# EAGLE design sfg_clone (EAGLE 6.5.0)
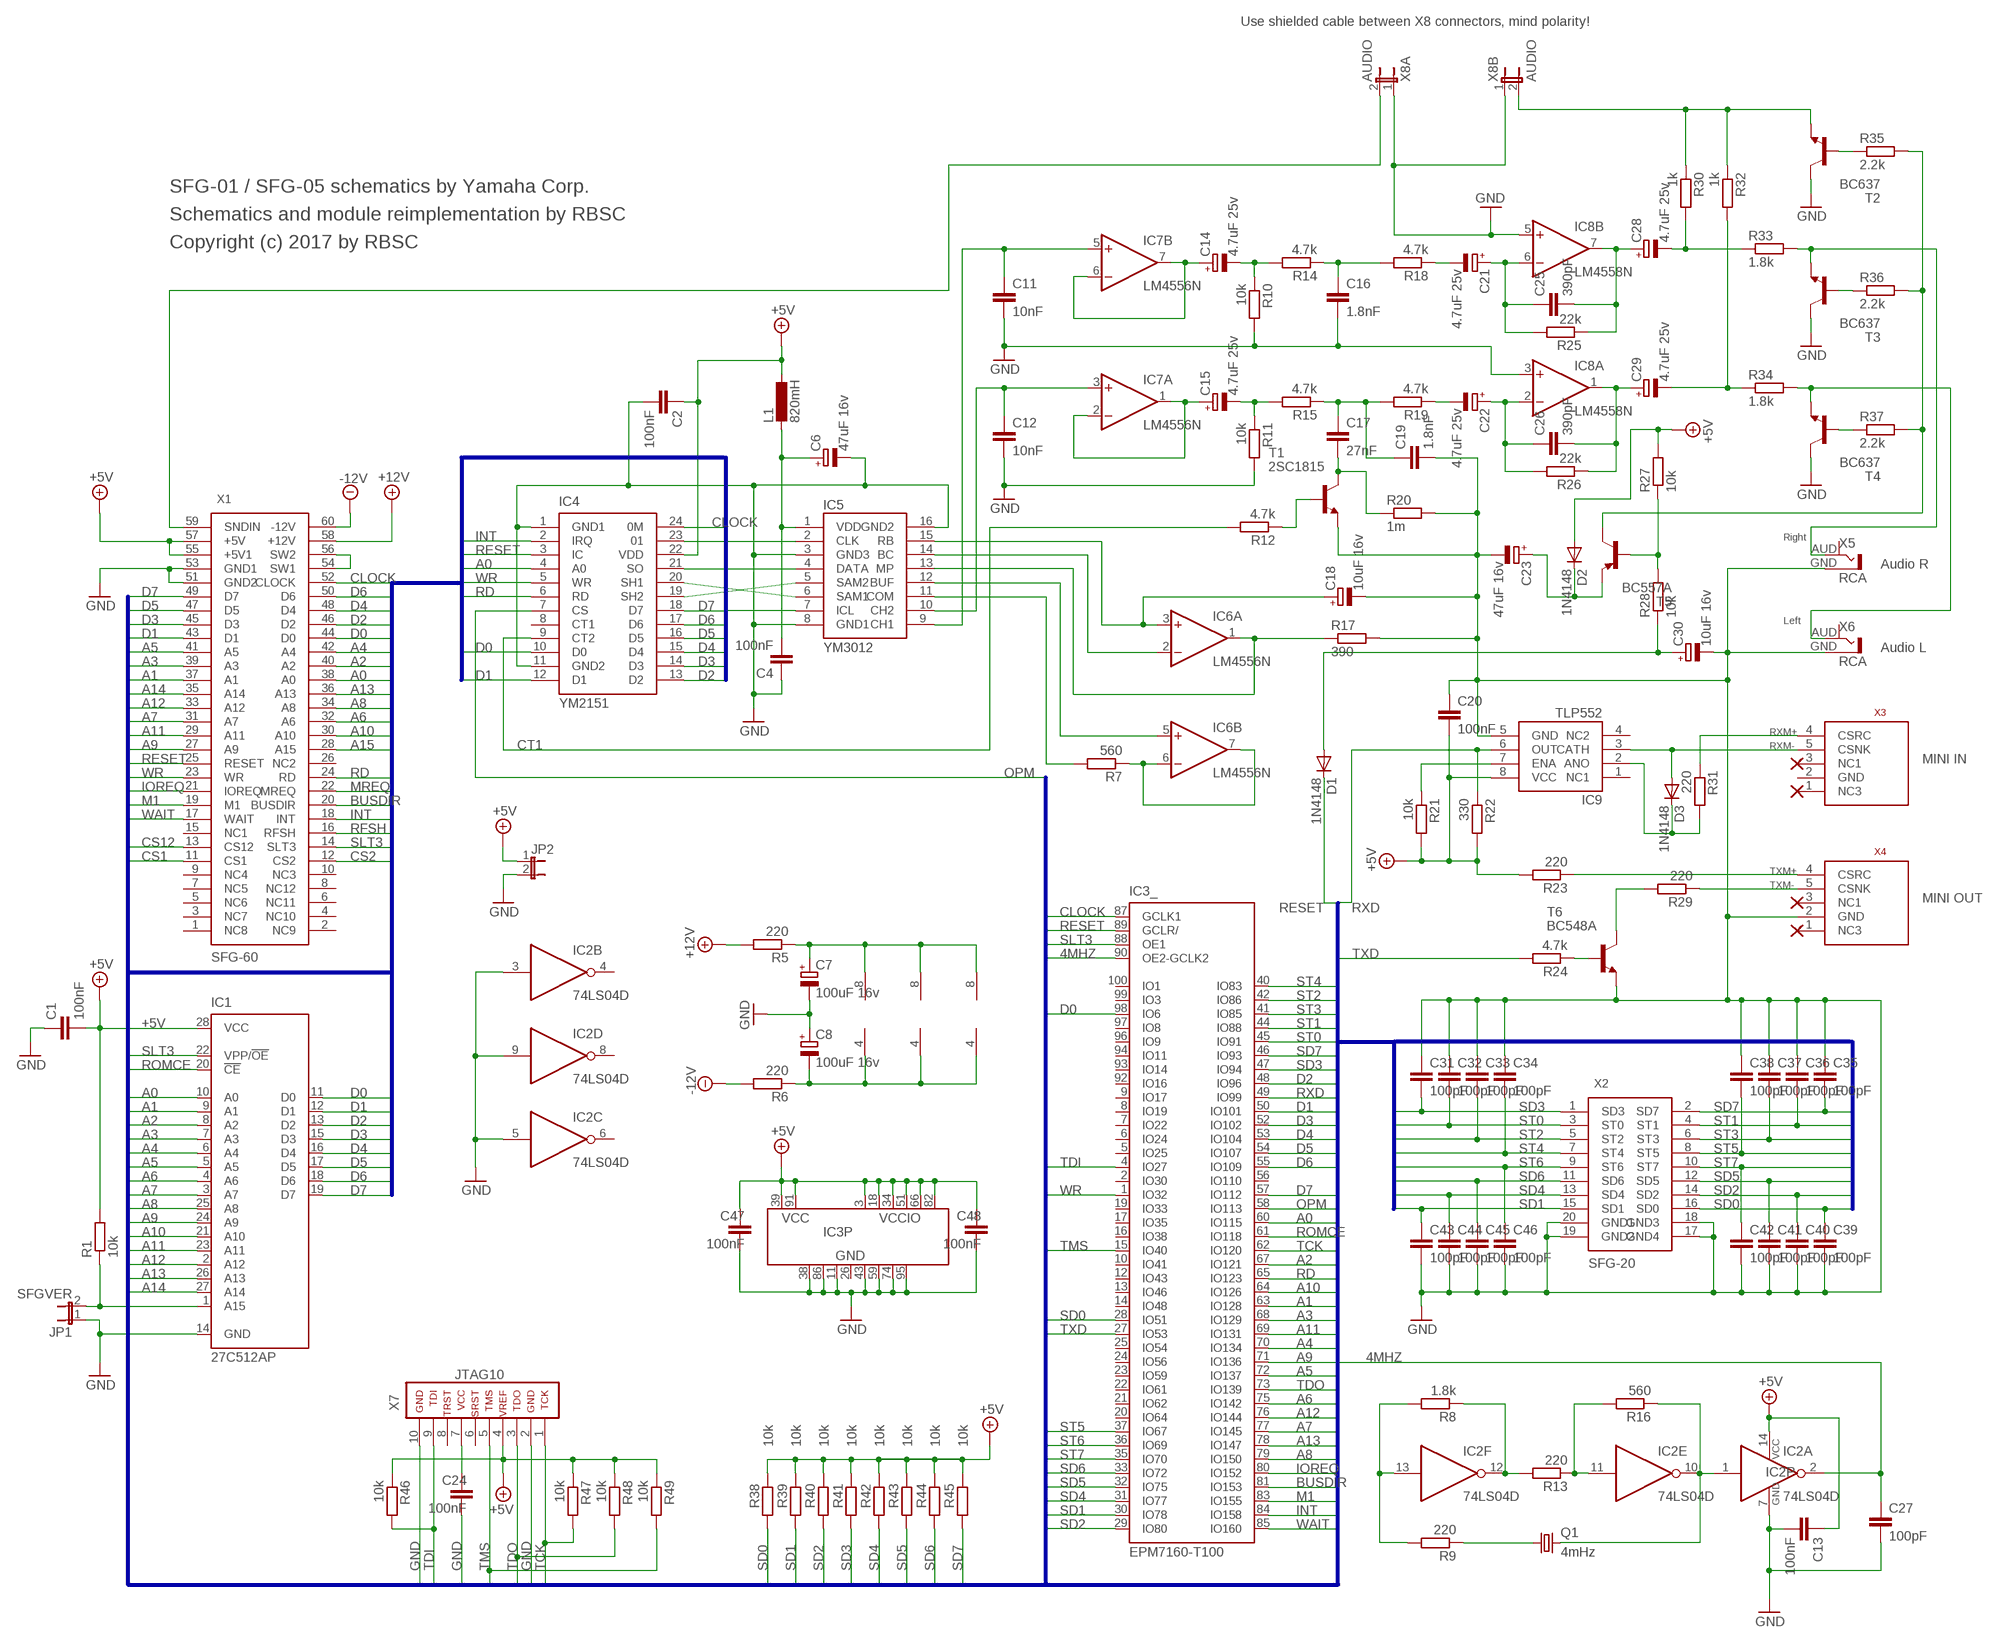
[diagram p0: schematic, sheet 1]

## Parts
C1  100nF  C-EUC0805  [C0805]
C2  100nF  C-EUC0805  [C0805]
C4  100nF  C-EUC0805  [C0805]
C6  47uF 16v  CPOL-EUSMCC  [SMC_C]
C7  100uF 16v  CPOL-EUSMCD  [SMC_D]
C8  100uF 16v  CPOL-EUSMCD  [SMC_D]
C11  10nF  C-EUC0805  [C0805]
C12  10nF  C-EUC0805  [C0805]
C13  100nF  C-EUC0805  [C0805]
C14  4.7uF 25v  CPOL-EUSMCB  [SMC_B]
C15  4.7uF 25v  CPOL-EUSMCB  [SMC_B]
C16  1.8nF  C-EUC0805  [C0805]
C17  27nF  C-EUC0805  [C0805]
C18  10uF 16v  CPOL-EUSMCB  [SMC_B]
C19  1.8nF  C-EUC0805  [C0805]
C20  100nF  C-EUC0805  [C0805]
C21  4.7uF 25v  CPOL-EUSMCB  [SMC_B]
C22  4.7uF 25v  CPOL-EUSMCB  [SMC_B]
C23  47uF 16v  CPOL-EUSMCC  [SMC_C]
C24  100nF  C-EUC0805  [C0805]
C25  390pF  C-EUC0805  [C0805]
C26  390pF  C-EUC0805  [C0805]
C27  100pF  C-EUC0805  [C0805]
C28  4.7uF 25v  CPOL-EUSMCB  [SMC_B]
C29  4.7uF 25v  CPOL-EUSMCB  [SMC_B]
C30  10uF 16v  CPOL-EUSMCB  [SMC_B]
C31  100pF  C-EUC0805  [C0805]
C32  100pF  C-EUC0805  [C0805]
C33  100pF  C-EUC0805  [C0805]
C34  100pF  C-EUC0805  [C0805]
C35  100pF  C-EUC0805  [C0805]
C36  100pF  C-EUC0805  [C0805]
C37  100pF  C-EUC0805  [C0805]
C38  100pF  C-EUC0805  [C0805]
C39  100pF  C-EUC0805  [C0805]
C40  100pF  C-EUC0805  [C0805]
C41  100pF  C-EUC0805  [C0805]
C42  100pF  C-EUC0805  [C0805]
C43  100pF  C-EUC0805  [C0805]
C44  100pF  C-EUC0805  [C0805]
C45  100pF  C-EUC0805  [C0805]
C46  100pF  C-EUC0805  [C0805]
C47  100nF  C-EUC0805  [C0805]
C48  100nF  C-EUC0805  [C0805]
D1  1N4148  DIODE-MINIMELF  [MINIMELF]
D2  1N4148  DIODE-MINIMELF  [MINIMELF]
D3  1N4148  DIODE-MINIMELF  [MINIMELF]
IC1  27C512AP  [DIL28-6]
IC2  74LS04D  [SO14]
IC3  EPM7160-T100  [TQFP100]
IC4  YM2151  [DIL24]
IC5  YM3012  [DIL16]
IC6  LM4556N  [DIL08]
IC7  LM4556N  [DIL08]
IC8  LM4558N  [DIL08]
IC9  TLP552  [DIL08]
JP1  SFGVER  JP1E  [JP1]
JP2  JP1E  [JP1]
L1  820mH  L-EU6000-XXX-RC  [6000-XXXX-RC]
Q1  4mHz  CRYSTALHC49S  [HC49/S]
R1  10k  R-EU_R0805  [R0805]
R5  220  R-EU_R0805  [R0805]
R6  220  R-EU_R0805  [R0805]
R7  560  R-EU_R0805  [R0805]
R8  1.8k  R-EU_R0805  [R0805]
R9  220  R-EU_R0805  [R0805]
R10  10k  R-EU_R0805  [R0805]
R11  10k  R-EU_R0805  [R0805]
R12  4.7k  R-EU_R0805  [R0805]
R13  220  R-EU_R0805  [R0805]
R14  4.7k  R-EU_R0805  [R0805]
R15  4.7k  R-EU_R0805  [R0805]
R16  560  R-EU_R0805  [R0805]
R17  390  R-EU_R0805  [R0805]
R18  4.7k  R-EU_R0805  [R0805]
R19  4.7k  R-EU_R0805  [R0805]
R20  1m  R-EU_R0805  [R0805]
R21  10k  R-EU_R0805  [R0805]
R22  330  R-EU_R0805  [R0805]
R23  220  R-EU_R0805  [R0805]
R24  4.7k  R-EU_R0805  [R0805]
R25  22k  R-EU_R0805  [R0805]
R26  22k  R-EU_R0805  [R0805]
R27  10k  R-EU_R0805  [R0805]
R28  10k  R-EU_R0805  [R0805]
R29  220  R-EU_R0805  [R0805]
R30  1k  R-EU_R0805  [R0805]
R31  220  R-EU_R0805  [R0805]
R32  1k  R-EU_R0805  [R0805]
R33  1.8k  R-EU_R0805  [R0805]
R34  1.8k  R-EU_R0805  [R0805]
R35  2.2k  R-EU_R0805  [R0805]
R36  2.2k  R-EU_R0805  [R0805]
R37  2.2k  R-EU_R0805  [R0805]
R38  10k  R-EU_R0805  [R0805]
R39  10k  R-EU_R0805  [R0805]
R40  10k  R-EU_R0805  [R0805]
R41  10k  R-EU_R0805  [R0805]
R42  10k  R-EU_R0805  [R0805]
R43  10k  R-EU_R0805  [R0805]
R44  10k  R-EU_R0805  [R0805]
R45  10k  R-EU_R0805  [R0805]
R46  10k  R-EU_R0805  [R0805]
R47  10k  R-EU_R0805  [R0805]
R48  10k  R-EU_R0805  [R0805]
R49  10k  R-EU_R0805  [R0805]
T1  2SC1815  [TO92-ECB]
T2  BC637  BC637-NPN-TO92-ECB  [TO92-ECB]
T3  BC637  BC637-NPN-TO92-ECB  [TO92-ECB]
T4  BC637  BC637-NPN-TO92-ECB  [TO92-ECB]
T5  BC557A  [TO92-EBC]
T6  BC548A  [TO92-EBC]
X1  SFG-60  [SFG-60]
X2  SFG-20  [SFG-20]
X3  MIDI_CONN_FEMALE_SUPPORT  [DIN_5_FEMALE_SUPPORT]
X4  MIDI_CONN_FEMALE_SUPPORT  [DIN_5_FEMALE_SUPPORT]
X5  RCA  [RCA]
X6  RCA  [RCA]
X7  JTAG10  [JTAG10]
X8A  AUDIO  JP1E  [JP1]
X8B  AUDIO  JP1E  [JP1]

## Nets
4MHZ: C27.1 IC2.2(A:O) IC3.90(_:OE2-GCLK2)
+5V: C1.2 C2.1 C13.1 C20.2 C47.1 C48.1 D2.A IC1.28(VCC) IC2.14(P:VCC) IC3.3(P:VCCIO) IC3.18(P:VCCIO) IC3.34(P:VCCIO) IC3.39(P:VCC) IC3.51(P:VCCIO) IC3.66(P:VCCIO) IC3.82(P:VCCIO) IC3.91(P:VCC) IC4.22(VDD) IC9.8(VCC) JP2.1 L1.1 R1.2 R21.2 R22.2 R23.2 R27.2 R38.1 R39.1 R40.1 R41.1 R42.1 R43.1 R44.1 R45.1 R46.1 R47.1 R48.1 R49.1 X1.55(+5V1) X1.57(+5V) X7.4
+12V: R5.2 X1.58(+12V)
+12V1: C7.+ IC6.8(P:V+) IC7.8(P:V+) IC8.8(P:V+) R5.1
-12V: R6.2 X1.60(-12V)
-12V1: C8.- IC6.4(P:V-) IC7.4(P:V-) IC8.4(P:V-) R6.1
A0: IC1.10(A0) IC3.60(_:IO115) IC4.4(A0) X1.38(A0)
A1: IC1.9(A1) IC3.63(_:IO128) X1.37(A1)
A2: IC1.8(A2) IC3.67(_:IO121) X1.40(A2)
A3: IC1.7(A3) IC3.68(_:IO129) X1.39(A3)
A4: IC1.6(A4) IC3.70(_:IO134) X1.42(A4)
A5: IC1.5(A5) IC3.72(_:IO137) X1.41(A5)
A6: IC1.4(A6) IC3.75(_:IO142) X1.32(A6)
A7: IC1.3(A7) IC3.77(_:IO145) X1.31(A7)
A8: IC1.25(A8) IC3.79(_:IO150) X1.34(A8)
A9: IC1.24(A9) IC3.71(_:IO136) X1.27(A9)
A10: IC1.21(A10) IC3.64(_:IO126) X1.30(A10)
A11: IC1.23(A11) IC3.69(_:IO131) X1.29(A11)
A12: IC1.2(A12) IC3.76(_:IO144) X1.33(A12)
A13: IC1.26(A13) IC3.78(_:IO147) X1.36(A13)
A14: IC1.27(A14) X1.35(A14)
A15: X1.28(A15)
BUSDIR: IC3.81(_:IO153) X1.20(BUSDIR)
CLOCK: IC3.87(_:GCLK1) IC4.24(0M) X1.52(CLOCK)
CS1: X1.11(CS1)
CS2: X1.12(CS2)
CS12: X1.13(CS12)
CT1: IC4.9(CT2) R12.2
D0: IC1.11(D0) IC3.98(_:IO6) IC4.10(D0) X1.44(D0)
D1: IC1.12(D1) IC3.50(_:IO101) IC4.12(D1) X1.43(D1)
D2: IC1.13(D2) IC3.48(_:IO96) IC4.13(D2) X1.46(D2)
D3: IC1.15(D3) IC3.52(_:IO102) IC4.14(D3) X1.45(D3)
D4: IC1.16(D4) IC3.53(_:IO104) IC4.15(D4) X1.48(D4)
D5: IC1.17(D5) IC3.54(_:IO107) IC4.16(D5) X1.47(D5)
D6: IC1.18(D6) IC3.55(_:IO109) IC4.17(D6) X1.50(D6)
D7: IC1.19(D7) IC3.57(_:IO112) IC4.18(D7) X1.49(D7)
GND: C1.1 C2.2 C4.1 C6.- C7.- C8.+ C11.2 C12.2 C13.2 C16.2 C18.- C19.2 C20.1 C23.- C24.2 C27.2 C30.- C31.1 C32.1 C33.1 C34.1 C35.1 C36.1 C37.1 C38.1 C39.2 C40.2 C41.2 C42.2 C43.2 C44.2 C45.2 C46.2 C47.2 C48.2 IC1.14(GND) IC2.3(B:I) IC2.5(C:I) IC2.7(P:GND) IC2.9(D:I) IC3.11(P:GND) IC3.38(P:GND) IC3.43(P:GND) IC3.59(P:GND) IC3.74(P:GND) IC3.86(P:GND) IC3.95(P:GND) IC4.1(GND1) IC4.11(GND2) IC5.3(GND3) IC5.8(GND1) IC5.16(GND2) IC8.3(A:+IN) IC8.5(B:+IN) IC9.5(GND) JP1.1 JP2.2 R10.2 R11.2 R17.2 R20.2 T1.E T2.C T3.C T4.C T6.E X1.51(GND2) X1.53(GND1) X2.17(GND4) X2.18(GND3) X2.19(GND2) X2.20(GND1) X4.2(GND) X5.GND(GND1) X6.GND(GND1) X7.2 X7.10 X8A.1 X8B.1
INT: IC3.84(_:IO158) IC4.2(IRQ) X1.18(INT)
IOREQ: IC3.80(_:IO152) X1.21(IOREQ)
M1: IC3.83(_:IO155) X1.19(M1)
MREQ: X1.22(MREQ)
N$1: IC1.1(A15) JP1.2 R1.1
N$2: C24.1 X7.7
N$3: X1.54(SW1) X1.56(SW2)
N$4: R30.1 R32.1 T2.E X8B.2
N$5: X1.59(SNDIN) X8A.2
N$8: IC2.13(F:I) R8.2 R9.2
N$13: IC2.12(F:O) R8.1 R13.2
N$15: IC2.1(A:I) IC2.10(E:O) Q1.2 R16.1
N$16: Q1.1 R9.1
N$17: IC2.11(E:I) R13.1 R16.2
N$21: R24.1 T6.B
N$22: R29.2 T6.C
N$23: R29.1 X4.5(CSNK)
N$24: R23.1 X4.4(CSRC)
N$26: D3.A IC9.3(CATH) X3.5(CSNK)
N$27: R31.1 X3.4(CSRC)
N$28: IC9.7(ENA) R21.1
N$29: D3.C IC9.2(ANO) R31.2
N$30: IC4.23 IC5.2(CLK)
N$31: IC4.21(SO) IC5.4(DATA)
N$32: C28.- R30.2 R33.1
N$33: IC4.20(SH1) IC5.6(SAM1)
N$34: C4.2 C6.+ IC5.1(VDD) L1.2
N$35: IC4.19(SH2) IC5.5(SAM2)
N$37: IC6.6(B:-IN) IC6.7(B:OUT) R7.1
N$38: IC5.11(COM) R7.2
N$39: C12.1 IC5.10(CH2) IC7.3(A:+IN)
N$40: IC5.12(BUF) IC6.5(B:+IN)
N$41: IC5.13(MP) IC6.1(A:OUT) R17.1
N$42: C18.+ IC5.15(RB) IC6.3(A:+IN)
N$43: C21.+ C25.1 IC8.6(B:-IN) R25.2
N$44: C14.+ IC7.6(B:-IN) IC7.7(B:OUT)
N$45: C15.+ IC7.1(A:OUT) IC7.2(A:-IN)
N$46: C11.1 IC5.9(CH1) IC7.5(B:+IN)
N$47: C14.- R10.1 R14.2
N$48: C15.- R11.1 R15.2
N$49: IC5.14(BC) IC6.2(A:-IN)
N$50: C17.2 R20.1 T1.C
N$51: C16.1 R14.1 R18.2
N$52: C17.1 C19.1 R15.1 R19.2
N$53: C22.+ C26.1 IC8.2(A:-IN) R26.2
N$54: C22.- R19.1
N$55: C21.- R18.1
N$56: R12.1 T1.B
N$57: C26.2 C29.+ IC8.1(A:OUT) R26.1
N$58: C25.2 C28.+ IC8.7(B:OUT) R25.1
N$60: C29.- R32.2 R34.1
N$61: R33.2 T3.E X5.AUD
N$62: R34.2 T4.E X6.AUD
N$63: R35.1 T2.B
N$64: R35.2 R36.2 R37.2 T5.C
N$65: R36.1 T3.B
N$66: R37.1 T4.B
N$67: C30.+ D1.A R28.1
N$68: C23.+ D2.C T5.E
N$69: R27.1 R28.2 T5.B
OPM: IC3.58(_:IO113) IC4.7(CS)
RD: IC3.65(_:IO123) IC4.6(RD) X1.24(RD)
RESET: D1.C IC3.89(_:GCLR/) IC4.3(IC) IC5.7(ICL) X1.25(RESET)
RFSH: X1.16(RFSH)
ROMCE: IC1.20(!CE) IC3.61(_:IO118)
RXD: IC3.49(_:IO99) IC9.6(OUT) R22.1
SD0: C39.1 IC3.28(_:IO51) R38.2 X2.16(SD0)
SD1: C43.1 IC3.30(_:IO78) R39.2 X2.15(SD1)
SD2: C40.1 IC3.29(_:IO80) R40.2 X2.14(SD2)
SD3: C31.2 IC3.47(_:IO94) R41.2 X2.1(SD3)
SD4: C44.1 IC3.31(_:IO77) R42.2 X2.13(SD4)
SD5: C41.1 IC3.32(_:IO75) R43.2 X2.12(SD5)
SD6: C45.1 IC3.33(_:IO72) R44.2 X2.11(SD6)
SD7: C35.2 IC3.46(_:IO93) R45.2 X2.2(SD7)
SLT3: IC1.22(VPP/!OE) IC3.88(_:OE1) X1.14(SLT3)
ST0: C32.2 IC3.45(_:IO91) X2.3(ST0)
ST1: C36.2 IC3.44(_:IO88) X2.4(ST1)
ST2: C33.2 IC3.42(_:IO86) X2.5(ST2)
ST3: C37.2 IC3.41(_:IO85) X2.6(ST3)
ST4: C34.2 IC3.40(_:IO83) X2.7(ST4)
ST5: C38.2 IC3.37(_:IO67) X2.8(ST5)
ST6: C46.1 IC3.36(_:IO69) X2.9(ST6)
ST7: C42.1 IC3.35(_:IO70) X2.10(ST7)
TCK: IC3.62(_:IO120) R47.2 X7.1
TDI: IC3.4(_:IO27) R46.2 X7.9
TDO: IC3.73(_:IO139) R48.2 X7.3
TMS: IC3.15(_:IO40) R49.2 X7.5
TXD: IC3.27(_:IO53) R24.2
WAIT: IC3.85(_:IO160) X1.17(WAIT)
WR: IC3.1(_:IO32) IC4.5(WR) X1.23(WR)
Unconnected: IC2.4(B:O) IC2.6(C:O) IC2.8(D:O) IC3.2(_:IO30) IC3.5(_:IO25) IC3.6(_:IO24) IC3.7(_:IO22) IC3.8(_:IO19) IC3.9(_:IO17) IC3.10(_:IO41) IC3.12(_:IO43) IC3.13(_:IO46) IC3.14(_:IO48) IC3.16(_:IO38) IC3.17(_:IO35) IC3.19(_:IO33) IC3.20(_:IO64) IC3.21(_:IO62) IC3.22(_:IO61) IC3.23(_:IO59) IC3.24(_:IO56) IC3.25(_:IO54) IC3.56(_:IO110) IC3.92(_:IO16) IC3.93(_:IO14) IC3.94(_:IO11) IC3.96(_:IO9) IC3.97(_:IO8) IC3.99(_:IO3) IC3.100(_:IO1) IC4.8(CT1) IC9.1(NC1) IC9.4(NC2) X1.1(NC8) X1.2(NC9) X1.3(NC7) X1.4(NC10) X1.5(NC6) X1.6(NC11) X1.7(NC5) X1.8(NC12) X1.9(NC4) X1.10(NC3) X1.15(NC1) X1.26(NC2) X3.1(NC3) X3.2(GND) X3.3(NC1) X4.1(NC3) X4.3(NC1) X5.AUD1 X6.AUD1 X7.6 X7.8

## Buses
ST0,ST1,ST2,ST3,ST4,ST5,ST6,ST7,SD0,SD1,SD2,SD3,SD4,SD5,SD6,SD7
D0,D1,D2,D3,D4,D5,D6,D7,A0,A1,A2,A3,A4,A5,A6,A7,A8,A9,A10,A11,A12,A13,A14,A15,CS1,CS2,CS12,SLT3,RFSH,WAIT,INT,M1,BUSDIR,IOREQ,MREQ,WR,RD,RESET,GND,CLOCK,SW1,SW2,4MHZ,CS,OPM,TXD,RXD,ST0,ST1,ST2,ST3,ST4,ST5,ST6,ST7,SD0,SD1,SD2,SD3,SD4,SD5,SD6,SD7,TDI,TMS,TDO,TCK,ROMCE

## Notes on the sheet
- Use shielded cable between X8 connectors, mind polarity!
- SFG-01 / SFG-05 schematics by Yamaha Corp.
- Schematics and module reimplementation by RBSC
- Copyright (c) 2017 by RBSC
- Right
- Audio R
- Left
- Audio L
- RXM+
- RXM-
- MINI IN
- TXM+
- TXM-
- MINI OUT

## Power pins joined to a net without a drawn wire
GND: IC3.26(P:GND)

## Library data of the parts
C1 C2 C4 C11-C13 C16 C17 C19 C20 C24-C27 C31-C48 = rcl:C-EU: CAPACITOR, European symbol
C6-C8 C14 C15 C18 C21-C23 C28-C30 = rcl:CPOL-EU: POLARIZED CAPACITOR, European symbol
D1-D3 = diode:DIODE-: DIODE
IC1 = microchip:27*512A: CMOS EPROM 512 K (64 K x 8); MPN: M27C512-90B6; OC_FARNELL: 1642690; OC_NEWARK: 20M6389
IC2 = 74xx-eu:74*04: Hex INVERTER
IC3 = altera:EPM7160-?100: EPM7160E MAX 7000 family; MPN: EPM7160STC100-10N; OC_FARNELL: 1549429; OC_NEWARK: 51R9804
IC4 = ym2151:YM2151: SFG OPM Chip
IC5 = ym3012:YM3012: YM3012
IC6 IC7 = LM4556:*4556: OP AMP
IC8 = LM4558:*4558: OP AMP
IC9 = TLP552:TLP552: Optocoupler
JP1 JP2 X8A X8B = jumper:JP1E: JUMPER
L1 = rcl:L-EU: INDUCTOR, European symbol
Q1 = crystal:CRYSTAL: CRYSTAL; OC_FARNELL: 1667008; OC_NEWARK: unknown
R1 R5-R49 = resistor:R-EU_: RESISTOR, European symbol
T1 = transistor:2SC1815: NPN EPITAXIAL TRANSISTOR Source: TOSHIBA .. 2SC1815 1.pdf
T2-T4 = transistor:*-NPN-: NPN Transistror BF959 corrected 2008.03.06
T5 = transistor-pnp:BC557*: PNP Transistror
T6 = transistor-npn:BC548*: NPN Transistor
X1 = sfg-60:SFG-60: 60-pin connector side slot
X2 = sfg-20:SFG-20: 20-pin connector for keyboards
X3 X4 = SparkFun-Connectors:MIDI_CONN_FEMALE_SUPPORT: MIDI connector with strain relief (DIN-5 female)
X5 X6 = rca:RCA: RCA connector Cinch
X7 = jtag:JTAG10: AVR JTAG Debug/Programming Header

## Board
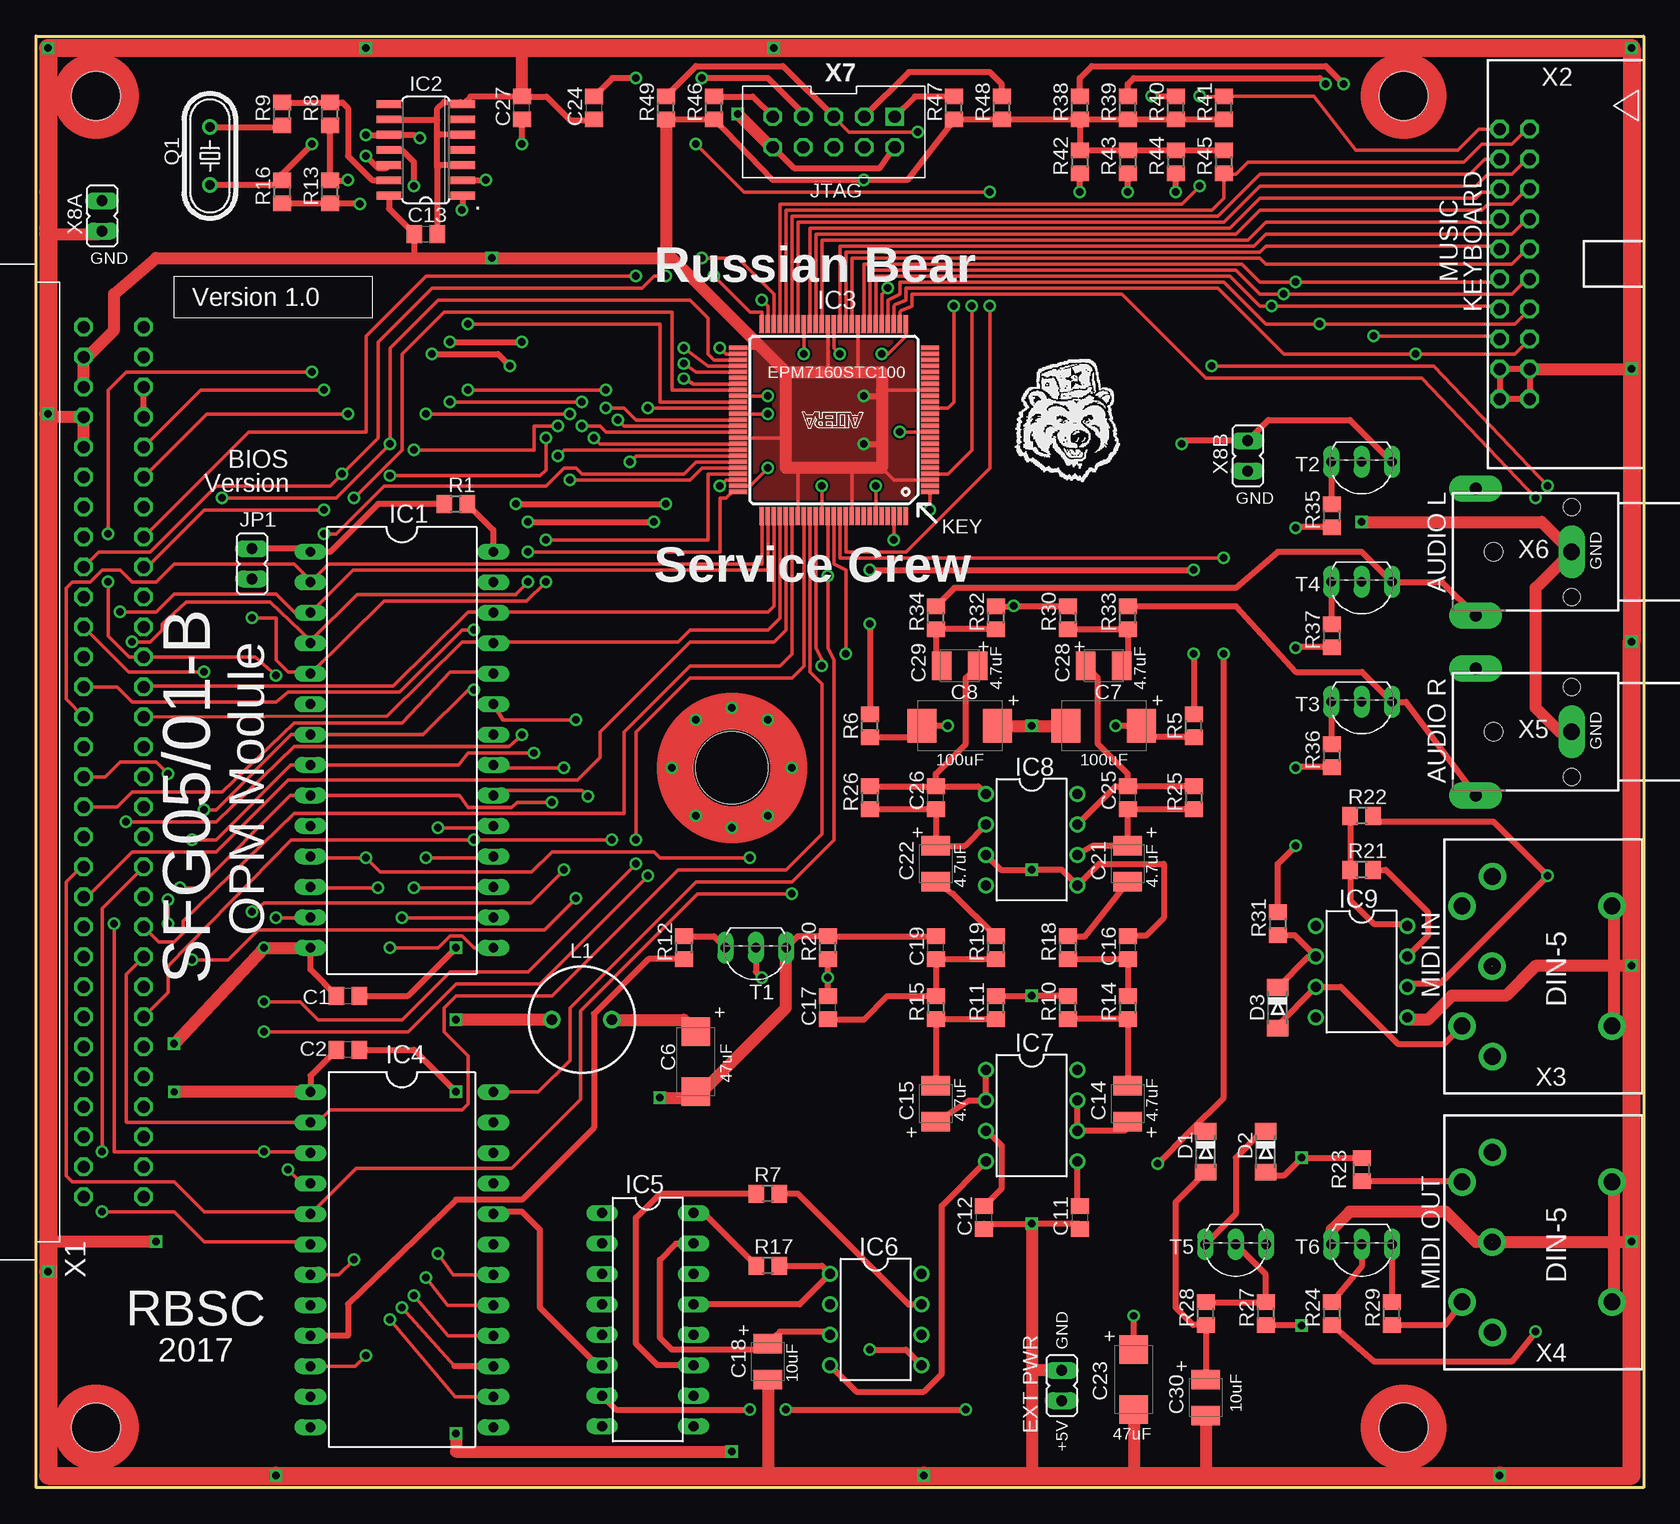
[diagram p1: board, top side]
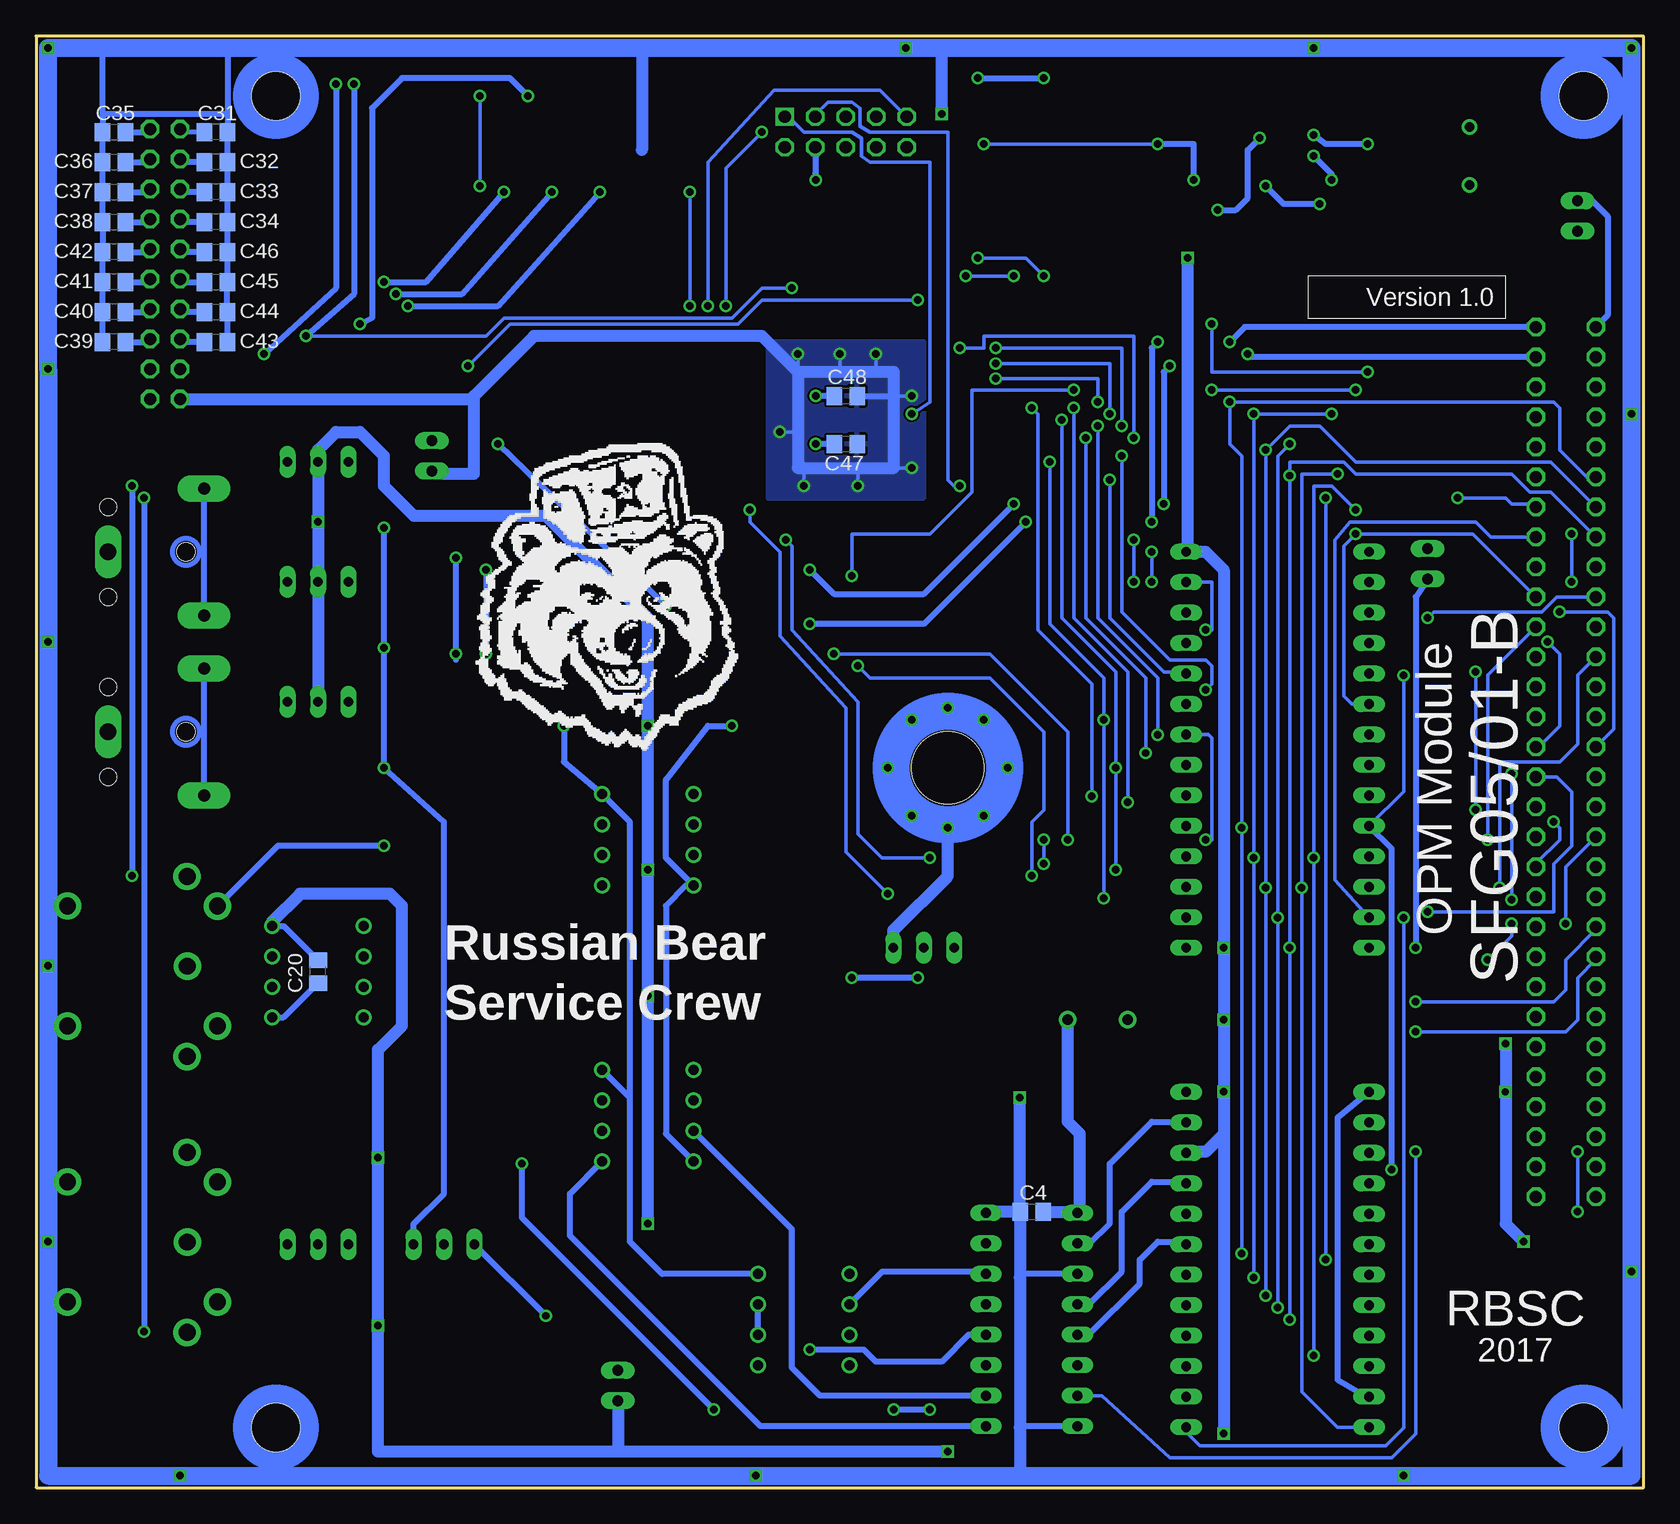
[diagram p2: board, bottom side, seen from below]

Size 134 x 121 mm. Coordinates in mm from the lower left corner, seen from the top.
Outline: 0,0 0,121 134,121 134,0 0,0
Copper layers (1*16): Top 0.035mm / dielectric 1.5mm / Bottom 0.035mm
Design rules "default *": minimum track width 10mil, minimum drill 24mil, track to track 7mil, track to pad 8mil, pad to pad 8mil, via to via 8mil, smd to smd 8mil, copper to edge 4mil, drill to drill 8mil, minimum pad ring 10mil, minimum via ring 8mil, stop-mask expansion 4mil, vias tented up to drill 24mil, thermal gap 10mil
Holes 4 mm at 5,116 5,5 114,116 114,5
Holes 6 mm at 58,60

### Footprints (pad centres in the part's own frame; a part is rotated, then mirrored left to right if it is on the bottom)
C0805 = smd 1.3 x 1.5: 1 -0.95,0; 2 0.95,0
SMC_C = smd 2.4 x 2.4: + -2.5,0; - 2.5,0
SMC_D = smd 2.4 x 2.8: + -3.15,0; - 3.15,0
SMC_B = smd 1.6 x 2.4: + -1.5,0; - 1.5,0
MINIMELF = smd 1.4 x 1.8: A 1.7,0; C -1.7,0
DIL28-6 = drill 0.813 long: 1 -16.51,-7.62; 2 -13.97,-7.62; 3 -11.43,-7.62; 4 -8.89,-7.62; 5 -6.35,-7.62; 6 -3.81,-7.62; 7 -1.27,-7.62; 8 1.27,-7.62; 9 3.81,-7.62; 10 6.35,-7.62; 11 8.89,-7.62; 12 11.43,-7.62; 13 13.97,-7.62; 14 16.51,-7.62; 15 16.51,7.62; 16 13.97,7.62; 17 11.43,7.62; 18 8.89,7.62; 19 6.35,7.62; 20 3.81,7.62; 21 1.27,7.62; 22 -1.27,7.62; 23 -3.81,7.62; 24 -6.35,7.62; 25 -8.89,7.62; 26 -11.43,7.62; 27 -13.97,7.62; 28 -16.51,7.62
SO14 = smd 0.66 x 2.032: 1 -3.81,-3.073; 2 -2.54,-3.073; 3 -1.27,-3.073; 4 0,-3.073; 5 1.27,-3.073; 6 2.54,-3.073; 7 3.81,-3.073; 8 3.81,3.073; 9 2.54,3.073; 10 1.27,3.073; 11 0,3.073; 12 -1.27,3.073; 13 -2.54,3.073; 14 -3.81,3.073
TQFP100 = smd 1.5 x 0.35: 1 -8,6; 2 -8,5.5; 3 -8,5; 4 -8,4.5; 5 -8,4; 6 -8,3.5; 7 -8,3; 8 -8,2.5; 9 -8,2; 10 -8,1.5; 11 -8,1; 12 -8,0.5; 13 -8,0; 14 -8,-0.5; 15 -8,-1; 16 -8,-1.5; 17 -8,-2; 18 -8,-2.5; 19 -8,-3; 20 -8,-3.5; 21 -8,-4; 22 -8,-4.5; 23 -8,-5; 24 -8,-5.5; 25 -8,-6; 51 8,-6; 52 8,-5.5; 53 8,-5; 54 8,-4.5; 55 8,-4; 56 8,-3.5; 57 8,-3; 58 8,-2.5; 59 8,-2; 60 8,-1.5; 61 8,-1; 62 8,-0.5; 63 8,0; 64 8,0.5; 65 8,1; 66 8,1.5; 67 8,2; 68 8,2.5; 69 8,3; 70 8,3.5; 71 8,4; 72 8,4.5; 73 8,5; 74 8,5.5; 75 8,6 | smd 0.35 x 1.5: 26 -6,-8; 27 -5.5,-8; 28 -5,-8; 29 -4.5,-8; 30 -4,-8; 31 -3.5,-8; 32 -3,-8; 33 -2.5,-8; 34 -2,-8; 35 -1.5,-8; 36 -1,-8; 37 -0.5,-8; 38 0,-8; 39 0.5,-8; 40 1,-8; 41 1.5,-8; 42 2,-8; 43 2.5,-8; 44 3,-8; 45 3.5,-8; 46 4,-8; 47 4.5,-8; 48 5,-8; 49 5.5,-8; 50 6,-8; 76 6,8; 77 5.5,8; 78 5,8; 79 4.5,8; 80 4,8; 81 3.5,8; 82 3,8; 83 2.5,8; 84 2,8; 85 1.5,8; 86 1,8; 87 0.5,8; 88 0,8; 89 -0.5,8; 90 -1,8; 91 -1.5,8; 92 -2,8; 93 -2.5,8; 94 -3,8; 95 -3.5,8; 96 -4,8; 97 -4.5,8; 98 -5,8; 99 -5.5,8; 100 -6,8
DIL24 = drill 0.813 long: 1 -13.97,-7.62; 2 -11.43,-7.62; 3 -8.89,-7.62; 4 -6.35,-7.62; 5 -3.81,-7.62; 6 -1.27,-7.62; 7 1.27,-7.62; 8 3.81,-7.62; 9 6.35,-7.62; 10 8.89,-7.62; 11 11.43,-7.62; 12 13.97,-7.62; 13 13.97,7.62; 14 11.43,7.62; 15 8.89,7.62; 16 6.35,7.62; 17 3.81,7.62; 18 1.27,7.62; 19 -1.27,7.62; 20 -3.81,7.62; 21 -6.35,7.62; 22 -8.89,7.62; 23 -11.43,7.62; 24 -13.97,7.62
DIL16 = drill 0.813 long: 1 -8.89,-3.81; 2 -6.35,-3.81; 3 -3.81,-3.81; 4 -1.27,-3.81; 5 1.27,-3.81; 6 3.81,-3.81; 7 6.35,-3.81; 8 8.89,-3.81; 9 8.89,3.81; 10 6.35,3.81; 11 3.81,3.81; 12 1.27,3.81; 13 -1.27,3.81; 14 -3.81,3.81; 15 -6.35,3.81; 16 -8.89,3.81
DIL08 = drill 0.813 pad 1.27: 1 -3.81,-3.81; 2 -1.27,-3.81; 3 1.27,-3.81; 4 3.81,-3.81; 5 3.81,3.81; 6 1.27,3.81; 7 -1.27,3.81; 8 -3.81,3.81
JP1 = drill 0.914 long: 1 0,-1.27; 2 0,1.27
6000-XXXX-RC = drill 0.9 pad 1.422: 1 -2.5,0; 2 2.5,0
HC49/S = drill 0.813: 1 -2.413,0; 2 2.413,0
R0805 = smd 1.3 x 1.5: 1 -0.95,0; 2 0.95,0
TO92-ECB = drill 0.813 long: B 2.54,0; C 0,0; E -2.54,0
TO92-EBC = drill 0.813 long: B 0,-1.27; C -2.54,-1.27; E 2.54,-1.27
SFG-60 = drill 1 octagon: 1 -36.25,3.54; 2 -36.25,-1.46; 3 -33.75,3.54; 4 -33.75,-1.46; 5 -31.25,3.54; 6 -31.25,-1.46; 7 -28.75,3.54; 8 -28.75,-1.46; 9 -26.25,3.54; 10 -26.25,-1.46; 11 -23.75,3.54; 12 -23.75,-1.46; 13 -21.25,3.54; 14 -21.25,-1.46; 15 -18.75,3.54; 16 -18.75,-1.46; 17 -16.25,3.54; 18 -16.25,-1.46; 19 -13.75,3.54; 20 -13.75,-1.46; 21 -11.25,3.54; 22 -11.25,-1.46; 23 -8.75,3.54; 24 -8.75,-1.46; 25 -6.25,3.54; 26 -6.25,-1.46; 27 -3.75,3.54; 28 -3.75,-1.46; 29 -1.25,3.54; 30 -1.25,-1.46; 31 1.25,3.54; 32 1.25,-1.46; 33 3.75,3.54; 34 3.75,-1.46; 35 6.25,3.54; 36 6.25,-1.46; 37 8.75,3.54; 38 8.75,-1.46; 39 11.25,3.54; 40 11.25,-1.46; 41 13.75,3.54; 42 13.75,-1.46; 43 16.25,3.54; 44 16.25,-1.46; 45 18.75,3.54; 46 18.75,-1.46; 47 21.25,3.54; 48 21.25,-1.46; 49 23.75,3.54; 50 23.75,-1.46; 51 26.25,3.54; 52 26.25,-1.46; 53 28.75,3.54; 54 28.75,-1.46; 55 31.25,3.54; 56 31.25,-1.46; 57 33.75,3.54; 58 33.75,-1.46; 59 36.25,3.54; 60 36.25,-1.46
SFG-20 = drill 1 octagon: 1 5.75,1; 2 5.75,3.5; 3 8.25,1; 4 8.25,3.5; 5 10.75,1; 6 10.75,3.5; 7 13.25,1; 8 13.25,3.5; 9 15.75,1; 10 15.75,3.5; 11 18.25,1; 12 18.25,3.5; 13 20.75,1; 14 20.75,3.5; 15 23.25,1; 16 23.25,3.5; 17 25.75,1; 18 25.75,3.5; 19 28.25,1; 20 28.25,3.5
DIN_5_FEMALE_SUPPORT = drill 1.4 pad 2.286: 1 7.94,3.6; 2 0.46,3.61; 3 -7.07,3.6; 4 5.47,6.13; 5 -4.53,6.12; 6 -4.53,-6.382; 7 5.478,-6.382
RCA = drill 1 pad 2.2 long: AUD 5.3,-12; AUD1 -5.283,-12 | drill 1.4 pad 2.2 long: GND 0,-4 | hole 1.4: -3.75,-4; 3.75,-4 | hole 1.5: 0,-10.5
JTAG10 = drill 1.016 square: 1 -5.08,-1.27 | drill 1.016 octagon: 2 -5.08,1.27; 3 -2.54,-1.27; 4 -2.54,1.27; 5 0,-1.27; 6 0,1.27; 7 2.54,-1.27; 8 2.54,1.27; 9 5.08,-1.27; 10 5.08,1.27

### Placement (x,y rotation side)
C1  26,41 0 top
C2  26,36.5 180 top
C4  51,23 0 bottom
C6  55,35.5 270 top
C7  89,63.5 180 top
C8  77,63.5 180 top
C11  87,22.5 270 top
C12  79,22.5 270 top
C13  32.5,104.5 0 top
C14  91,32 90 top
C15  75,32 90 top
C16  91,45 90 top
C17  66,40 90 top
C18  61,10.5 270 top
C19  75,45 90 top
C20  110.5,43 90 bottom
C21  91,52 270 top
C22  75,52 270 top
C23  91.5,9 270 top
C24  46.5,115 270 top
C25  91,57.5 90 top
C26  75,57.5 90 top
C27  40.5,115 90 top
C28  89,68.5 0 top
C29  77,68.5 180 top
C30  97.5,7.5 270 top
C31  119,113 180 bottom
C32  119,110.5 180 bottom
C33  119,108 180 bottom
C34  119,105.5 180 bottom
C35  127.5,113 0 bottom
C36  127.5,110.5 0 bottom
C37  127.5,108 0 bottom
C38  127.5,105.5 0 bottom
C39  127.5,95.5 180 bottom
C40  127.5,98 180 bottom
C41  127.5,100.5 180 bottom
C42  127.5,103 180 bottom
C43  119,95.5 0 bottom
C44  119,98 0 bottom
C45  119,100.5 0 bottom
C46  119,103 0 bottom
C47  66.5,87 0 bottom
C48  66.5,91 0 bottom
D1  97.5,28 270 top
D2  102.5,28 270 top
D3  103.5,40 270 top
IC1  30.5,61.5 270 top
IC2  32.5,111.5 90 top
IC3  66.5,89 180 top
IC4  30.5,19 270 top
IC5  51,14 270 top
IC6  70,14 270 top
IC7  83,31 270 top
IC8  83,54 270 top
IC9  110.5,43 270 top
JP1  18,77 0 top
JP2  85.5,8.5 0 top
L1  45.5,39 0 top
Q1  14.5,111 270 top
R1  35,82 0 top
R5  96.5,63.5 90 top
R6  69.5,63.5 90 top
R7  61,24.5 180 top
R8  24.5,114.5 90 top
R9  20.5,114.5 90 top
R10  86,40 90 top
R11  80,40 90 top
R12  54,45 270 top
R13  24.5,108 90 top
R14  91,40 270 top
R15  75,40 270 top
R16  20.5,108 270 top
R17  61,18.5 180 top
R18  86,45 270 top
R19  80,45 270 top
R20  66,45 90 top
R21  110.5,51.5 180 top
R22  110.5,56 180 top
R23  110.5,26.5 90 top
R24  108,14.5 270 top
R25  96.5,57.5 270 top
R26  69.5,57.5 270 top
R27  102.5,14.5 270 top
R28  97.5,14.5 90 top
R29  113,14.5 90 top
R30  86,72.5 270 top
R31  103.5,47 270 top
R32  80,72.5 270 top
R33  91,72.5 90 top
R34  75,72.5 90 top
R35  108,81 270 top
R36  108,61 270 top
R37  108,71 270 top
R38  87,115 90 top
R39  91,115 90 top
R40  95,115 90 top
R41  99,115 90 top
R42  87,110.5 270 top
R43  91,110.5 270 top
R44  95,110.5 270 top
R45  99,110.5 270 top
R46  56.5,115 90 top
R47  76.5,115 90 top
R48  80.5,115 90 top
R49  52.5,115 90 top
T1  60,45 180 top
T2  110.5,85.5 180 top
T3  110.5,65.5 180 top
T4  110.5,75.5 180 top
T5  100,19 180 top
T6  110.5,19 180 top
X1  7.5,60.5 90 top
X2  121,119 270 top
X3  125,43 90 top
X4  125,20 90 top
X5  132,63 270 top
X6  132,78 270 top
X7  66.5,113 180 top
X8A  5.5,106 0 top
X8B  101,86 0 top

### Tracks (layer width: path | path; a pad name or v marks a point on that pad's centre or on a via)
4MHZ  (via drill 0.6)
  Top 0.3: IC3.90 67.5,78 72.5,78 79.5,85 v79.5,98.5 | v79.5,108 59,108 v55,112
  Top 0.5: IC2.2 37.46,108.96 v37.5,109 | v40.5,112 C27.1
  Bottom 0.3: v55,112 v40.5,112 | v79.5,98.5 v79.5,108
  Bottom 0.5: v37.5,109 37.5,112 v40.5,112
+5V  (via drill 0.6)
  Top 0.3: IC3.39 66,93.5 65.5,93 | IC3.66 62.5,87.5 | 68.5,93 IC3.34 | IC3.18 70.5,91.5 | IC3.91 68,85 | IC3.82 63.5,85 | IC3.3 71.5,84 70.5,85 | IC3.51 60,95 60.25,95.25
  Top 0.5: 31.5,102.5 31.55,102.55 C13.1 29.43,106.62 IC2.14 | R38.1 R39.1 R40.1 R41.1 | R38.1 R42.1 R43.1 R44.1 R45.1 | v69,91 70.5,91 | v69,87 70.5,87 | R49.1 R46.1 61.41,109 v69,109 72.64,109 76.5,114 R47.1 R48.1 R38.1 | D2.A 102.8,26 104,26 v105.5,27.5 105.55,27.45 R23.2 | R27.2 105.45,13.55 v105.5,13.5 | IC9.8 114.12,47 111.5,47 109.55,48.95 R21.2 R22.2 | R1.2 38.12,79.83 IC1.28 | C1.2 31,41 v35,45 | C2.1 31.5,36.5 v35,33
  Top 1: 52.5,102.5 v38,102.5 31.5,102.5 10,102.5 6.5,99.5 6.5,96.5 4.25,94.25 X1.57 X1.55 | 52.5,102.5 53,102.5 60.25,95.25 62.5,93 | 62.5,93 62.5,87.5 62.5,85 63.5,85 68,85 70.5,85 70.5,87 70.5,91 70.5,91.5 70.5,93 68.5,93 65.5,93 62.5,93 | L1.1 v35,39 | v35,4.5 35,3 v58,3 | R49.1 52.5,102.5
  Bottom 0.5: C48.1 v69,91 | X7.4 69.04,109.54 v69,109 | IC9.8 113.36,46.81 C20.2 | C47.1 v69,87
  Bottom 1: v38,102.5 38,78.5 38.12,77.88 IC1.28 36.51,78.01 35,76.5 v35,45 v35,39 v35,33 35,29.5 | 35,29.5 36.5,28 38.01,28 IC4.22 | 35,29.5 v35,4.5 | v58,3 85.5,3 | 85.5,3 105.5,3 v105.5,13.5 v105.5,27.5 105.5,36.5 103.5,38.5 103.5,48.5 104.5,49.5 112,49.5 114.31,47.19 IC9.8 | JP2.1 85.5,3
  pour Top: 60,95.5 73,95.5 73,82.5 60,82.5
+12V  (via drill 0.6)
  Top 0.5: v33,94.5 38.5,94.5 v39.5,93.5 | v40,82 v52.5,82 | v69.5,76.5 v96.5,76.5 | v96.5,69.5 R5.2
  Bottom 0.5: X1.58 32.75,94.25 v33,94.5 | v39.5,93.5 40,93 v40,82 | v52.5,82 60,74.5 67.5,74.5 v69.5,76.5 | v96.5,76.5 v96.5,69.5
+12V1  (via drill 0.6)
  Top 0.5: v90,63.5 C7.+ 93.1,62.55 R5.1
  Bottom 0.5: 86.81,35.19 IC7.8 84.5,32.5 | 84.5,32.5 84.5,55.5 IC8.8 90,60.5 v90,63.5 | 84.5,32.5 84.5,20.5 81.81,17.81 IC6.8
-12V  (via drill 0.6)
  Top 0.5: v34.5,95.5 v40.5,95.5 | v41,80.5 v51.5,80.5 | v69.5,72 R6.2
  Bottom 0.5: X1.60 33.25,96.75 v34.5,95.5 | v40.5,95.5 41,95 v41,80.5 | v51.5,80.5 60,72 v69.5,72
-12V1  (via drill 0.6)
  Top 0.5: IC6.4 68.38,8 74,8 75.5,9.5 75.5,23.5 IC7.4 | v76,63.5 C8.- 72.9,62.55 R6.1
  Bottom 0.5: IC7.4 81.5,29.5 81.5,48.5 79.81,50.19 IC8.4 81.5,52.5 81.5,59 78,63.5 v76,63.5
A0  (via drill 0.6)
  Top 0.3: 22.15,25.35 v21,26.5 | v20,67.7 18.25,69.25 X1.38 7.75,69.25 6,71 v6,75.5 | v6,79.5 6,91.5 7.5,93 v23,93 | IC3.60 52,90.5 52,97 v36,97
  Top 0.5: IC4.4 22.15,25.35
  Bottom 0.3: v20,67.7 20,58.03 IC1.10 | v6,75.5 v6,79.5 | v23,93 36,93 v36,97
  Bottom 0.5: v21,26.5 21,53.27 IC1.10
A1  (via drill 0.6)
  Top 0.3: v43,57.12 42.5,57.1 40.1,57.1 39.65,56.68 36,56.68 35.31,57.69 IC1.9 21.19,57.69 13.5,50 v12,50 | IC3.63 50,89 49,90 v47.5,90
  Bottom 0.3: v12,50 12,60.5 7,60.5 5.5,62 5.5,67.71 X1.37 | v43,57.12 43,68 47.5,72.5 v47.5,90
A2  (via drill 0.6)
  Top 0.3: v41.5,61.22 36,61.22 35.23,60.23 IC1.8 21.23,60.23 15,54 v13,54 | IC3.67 47,87 v46.5,87.5
  Bottom 0.3: v13,54 13,67.71 X1.40 | v41.5,61.22 41.5,67.5 46.5,72.5 v46.5,87.5
A3  (via drill 0.6)
  Top 0.3: v36.5,66.5 36,66.5 32.27,62.77 IC1.7 21.27,62.77 15,56.5 v14,56.5 | v14,68 7.71,68 X1.39 | IC3.68 44,86.5 v43.5,86
  Bottom 0.3: v14,56.5 v14,68 | v36.5,66.5 36,67 36,68.5 36.5,69 39.5,69 43.5,73 v43.5,86
A4  (via drill 0.6)
  Top 0.3: v24,79.5 25,79.5 29,83.5 42.5,83.5 44,85 45,85 45.5,84.5 54,84.5 55,85.5 IC3.70
  Bottom 0.3: IC1.6 24.31,65.31 25,66 25,78.5 v24,79.5 14.21,79.5 X1.42
A5  (via drill 0.6)
  Top 0.3: IC3.72 56,84.5 56,79 v42.5,79 | v42.5,75.5 40.9,73.9 29.03,73.9 IC1.5 22.73,68 21,68 20,69 20,72.5 v18,72.5
  Bottom 0.3: X1.41 7.25,74.25 8.5,73 17.5,73 v18,72.5 | v42.5,75.5 v42.5,79
A6  (via drill 0.6)
  Top 0.3: IC3.75 58,83 57.5,82.5 57,82.5 57,78 v41,78 | IC1.4 22.88,70.62 | 22.88,70.62 19.5,73.8 12.5,73.8 10.5,72 10.5,71.5 9.5,70.5 v8,70.5 | 22.88,70.62 26.76,74.45 40,74.45 40,74.5 v41,75.5
  Bottom 0.3: X1.32 8.75,61.75 7,63.5 7,69.5 v8,70.5 | v41,75.5 v41,78
A7  (via drill 0.6)
  Top 0.3: v7,73 10,73 11.5,74.5 20,74.5 21.57,72.93 IC1.3 26.45,76.5 61,76.5 IC3.77
  Bottom 0.3: v7,73 3,73 2.5,72.5 2.5,63.21 X1.31
A8
  Top 0.3: X1.34 29.25,64.3 35.5,70.5 38.01,70.5 IC1.25 38.23,70.5 53.5,70.5 54.5,71.5 61,71.5 62,72.5 IC3.79
A9  (via drill 0.6)
  Top 0.3: X1.27 6.75,56.75 8,58 15.5,58 21.5,63.75 30.5,63.75 34.5,68 37.97,68 IC1.24 | IC3.71 55.5,85 54.5,84 v44.5,84
  Bottom 0.3: v44.5,84 44.5,72.5 40,68 38.27,68 IC1.24
A10  (via drill 0.6)
  Top 0.3: v18,48 19,48.75 40.25,48.75 | IC3.64 49,88.5 v48.5,89 | 38.35,60 IC1.21
  Top 0.305: 38.35,60 v44,60 | 40.25,48.75 41.25,48.75 v44,51.5
  Bottom 0.3: 6,58 6,53.5 7.5,52 7.5,48 v18,48 | v44,60 44,68 48.5,72.5 v48.5,89
  Bottom 0.305: v44,60 v44,51.5 | 6,58 7.25,59.25 X1.30
A11  (via drill 0.6)
  Top 0.3: X1.29 5.75,59.25 7,60.5 10,60.5 v11,59.5 | v11,49 v11,47 | v13,44 16,44 18.5,46.5 42,46.5 | v45,64 38.93,64 IC1.23 | IC3.69 50,86 v49.5,85.5
  Top 0.305: 42,46.5 42.38,46.5 v45,49.12
  Bottom 0.3: v11,59.5 v11,49 | v11,47 11,46 v13,44 | v45,64 45,67.5 49.5,72 v49.5,85.5
  Bottom 0.305: v45,49.12 v45,64
A12
  Top 0.3: X1.33 2.5,65.71 2.5,75 3,75.5 4.5,75.5 5.5,76.5 7,76.5 8,75.5 10,75.5 11.5,77 21.5,77 22.88,75.62 IC1.2 24.41,77 60.5,77 IC3.76
A13
  Top 0.3: X1.36 9.01,66.8 29.75,66.8 36,73 38.05,73 IC1.26 38.19,73 61,73 61.5,73.5 IC3.78
A14  (via drill 0.6)
  Top 0.3: X1.35 6.75,66.75 8,65.5 20,65.5 21,66.3 30.3,66.3 35.5,71.5 v36.5,71.5
  Bottom 0.3: v36.5,71.5 36,71.5 36,75.5 36.03,75.47 IC1.27
BUSDIR
  Top 0.3: IC3.81 63,69.5 62,68.5 54.5,68.5 49,63 49,56.17 21.5,56.17 12.25,47.25 12.25,46.25 11.5,45.5 10.21,45.5 X1.20
CLOCK  (via drill 0.6)
  Top 0.3: 63,50.5 66.5,54 66.5,69 66,70 v66,76 IC3.87 | v47.5,91.5 v36,91.5 | v24,91.5 13.71,91.5 X1.52
  Top 0.305: IC4.24 41.84,32.97 44.5,35.62 44.5,40 55,50.5 63,50.5
  Bottom 0.3: v24,91.5 v36,91.5 | v66,76 66,79.5 59.5,79.5 56,83 56,91.5 v47.5,91.5
CT1
  Top 0.5: R12.2 51.05,44.05 46.5,39.5 46.5,30 40.5,24 35,24 26,15.31 26,12.65 IC4.9
D0  (via drill 0.6)
  Top 0.3: IC3.98 v71.5,79 | IC4.10 26.61,10.11 v27.5,11 | v27.5,52.5 22.99,52.5 IC1.11 | 43,53 51.5,53 52,52.5 v59.5,52.5 | 40.5,51.3 29,51.3 | v24,81.5 14,81.5 9.25,76.75 X1.44
  Top 0.305: 40.5,51.3 41.3,51.3 43,53 | 29,51.3 28.7,51.3 v27.5,52.5
  Bottom 0.3: v27.5,11 v27.5,52.5 27.5,83.5 26,83.5 v24,81.5 | v71.5,79 71,78.5 71,71.5 65.5,65.5 65.5,54.5 63.5,52.5 v59.5,52.5
D1  (via drill 0.6)
  Top 0.3: IC3.50 60.5,98 59.5,98 v56.5,101 | v52.5,101 51.5,101 50.5,100 33,100 28.5,95.5 28.5,87.5 v25.5,84.5 24.5,83.5 15,83.5 9.5,78 5.21,78 X1.43 | v28.5,50 22.95,50 IC1.12
  Bottom 0.3: v56.5,101 v52.5,101 | IC4.12 25.53,5.03 28.5,8 v28.5,50 28.5,84.5 v25.5,84.5
D2  (via drill 0.6)
  Top 0.3: IC3.48 61.5,99.5 58.5,102.5 v55.5,102.5 | v50,101 32.5,101 27.5,96 27.5,88 17.71,88 X1.46 | v20,47.5 22.85,47.5 IC1.13
  Bottom 0.3: v55.5,102.5 51.5,102.5 v50,101 | IC4.13 38.12,4.62 37,3.5 21.5,3.5 20,5 v20,47.5 | IC1.13 25.75,50.65 25.75,79 24.5,80.5 14,80.5 12.75,79.25 X1.46
D3  (via drill 0.6)
  Top 0.3: IC3.52 57.5,94.5 v57,95 | IC4.14 34.93,7.57 v29.5,14 | v29.5,45 33.5,45 34.5,46 35.5,46 36.5,45 IC1.15 | v29.5,84.35 42,84.35 42.5,84.8 v42.5,87.5
  Bottom 0.3: v57,95 55,95 55,96 42.5,96 v42.5,87.5 | v29.5,14 v29.5,45 v29.5,84.35 29.5,85.5 25,85.5 24,84.5 11,84.5 9.5,83 7.71,83 X1.45
D4  (via drill 0.6)
  Top 0.3: IC3.53 56.5,94 56,94.5 56,97.5 54.5,99 33.5,99 29.5,95 v29.5,87 25,82.5 v15.5,82.5 | 34.89,10.11 v30.5,15 | v30.5,47.5 38.09,47.5 IC1.16
  Top 0.5: IC4.15 34.89,10.11
  Bottom 0.3: v30.5,15 v30.5,47.5 30.5,86 v29.5,87 | v15.5,82.5 11.5,82.5 11,82 9.21,82 X1.48
D5  (via drill 0.6)
  Top 0.3: IC4.16 34.35,12.65 v31.5,16 | v31.5,50 38.05,50 IC1.17 | v31.5,86.5 41.5,86.5 41.5,88.5 v43.5,88.5 | IC3.54 56,93.5 v54,95
  Bottom 0.3: v31.5,16 v31.5,50 v31.5,86.5 29.5,88.5 27,88.5 24,85.5 7.71,85.5 X1.47 | v54,95 43.5,95 v43.5,88.5
D6  (via drill 0.6)
  Top 0.3: IC4.17 34.31,15.19 v32.5,17.5 | v32.5,52.5 38.01,52.5 IC1.18 | v32.5,89.5 v44.5,89.5 | IC3.55 55,93 v54,93.7 | v26,89.5 14.21,89.5 X1.50
  Bottom 0.3: v32.5,17.5 v32.5,52.5 v32.5,89.5 | v54,93.7 44.5,93.7 v44.5,89.5
  Bottom 0.305: v26,89.5 v32.5,89.5
D7  (via drill 0.6)
  Top 0.3: IC4.18 34.77,17.73 v33.5,19.5 | v33.5,55 37.97,55 IC1.19 | v34.5,90.5 v45.5,90.5 | IC3.57 54.8,92 v54,92.45
  Bottom 0.3: v33.5,19.5 v33.5,55 33.5,86 34.5,87 v34.5,90.5 | 4.25,84.25 X1.49 | v54,92.45 45.5,92.45 v45.5,90.5 | 25,90.5 7.5,90.5 7,90 7,87.5
  Bottom 0.305: 4.25,84.25 4.75,84.25 7,86.5 7,87.5 | 25,90.5 v34.5,90.5
GND  (via drill 0.6)
  Top 0.3: IC3.59 v61,91 | IC3.43 v64,94.5 | IC3.11 v72,88 | IC3.95 v70,83.5 | IC3.86 v65.5,83.5 | IC3.74 59.5,83.5 v61,85 | IC3.38 66.5,95 v67,94.5 | IC3.26 72.5,96 71,94.5 v70.5,94.5
  Top 0.5: X2.19 X2.20 X2.18 X2.17 | 33.45,110 33.45,113 | 33.45,113 33.45,114 | 33.45,114 33.45,114.95 34,115.5 35.38,115.5 IC2.7 36.21,115.95 C27.2 42.55,115.95 44.5,114 45.95,114 C24.2 | IC2.9 33.41,114.04 33.45,114 | IC2.5 33.68,112.77 33.45,113 | IC2.3 33.68,110.23 33.45,110 | X7.2 70.35,110 63.2,110 63,110.15 X7.10 | 132.96,20.46 131.96,20.46 131.5,20 | 132.96,43.46 131.54,43.46 131.5,43.5 | C12.2 79.05,22 v83,22 86.95,22 C11.2 | IC8.3 80.42,51.5 v83,51.5 85.5,51.5 IC8.5 88.62,52 94,52 94,47.5 92.5,46 91.05,46 C16.2 | R11.2 80.05,41 v83,41 85.95,41 R10.2 | C6.- 55,32.5 | C6.- 55,33.05 | C2.2 22.88,34.33 IC4.1 | C1.1 22.88,43.17 IC1.14 | 33.45,110 C13.2 | 122,93.3 X2.19 | 122,90.7 X2.19 | 40.5,119.9 40.6,120 | C6.- 55.5,33 | 62.5,44.96 T1.E 63.49,45.95 R20.2 C19.2 | R17.2 55.55,23 55.44,22.89 IC5.16
  Top 1: v1,89.5 1.25,89.25 X1.53 X1.51 | 57.87,1.13 61.5,1.1 | 61.5,1.1 67.99,1.05 | 67.99,1.05 v74,1 74.19,1.19 | v133,43.5 132.96,43.46 124.96,43.46 122.5,41 118,41 116,39 114.5,39 IC9.5 | X2.18 v133,93.25 | 1.27,108.27 1,108 | 20.85,119.85 v27.5,120 | 1,104.73 1,105 | 68,1.06 67.99,1.05 | v133,20.5 132.96,20.46 X4.2 120.04,20.46 117.5,23 109.5,23 108,21.5 108,20.31 T6.E | 1,104.5 5.27,104.5 X8A.1 | v11.5,37 v19,45 IC1.14 | v10,20.5 1,20.5 | IC4.1 v11.53,32.97 | C23.- 91.5,1 | C30.- 97.5,1 | 131.5,25.5 131.5,20 131.5,15.5 | 131.5,48.5 131.5,43.5 131.5,38.5 | C18.- 61,1.1 61.5,1.1 | v83,22 83,9.77 | 83,9.77 83,1 | v52,32.5 55,32.5 | X5.GND 127,63 125,65 125,75 X6.GND 125.5,80.5 v110.5,80.5 | JP2.2 83,9.77 | C8.+ v83,63.5 C7.- | C27.2 40.5,119.9 | X7.10 61.27,111.73 v58.5,114.5 | 55.5,33 62.5,40 62.5,44.96 | v53,60 v55,64 v58,65 v61,64 v63,60 v61,56 v58,55 v55,56 v53,60
  Top 1.5: v133,120 v61.5,120 40.6,120 v27.5,120 v1,120 1,108 1,105 1,104.5 v1,89.5 1,20.5 v1,18 1,1 v20,1 v74,1 83,1 91.5,1 97.5,1 v122,1 133,1 v133,20.5 v133,43.5 v133,70.5 v133,93.25 v133,120
  Bottom 0.3: C45.2 118,100.5 | v65.5,83.5 65.5,85 | v61,91 62,91 62.5,90.5 | v64,94.5 64,93 | v70.5,94.5 70.5,93 | v72,88 70.5,88 | v70,83.5 70,85 | v67,94.5 67,93 | v61,85 62.5,85
  Bottom 0.5: C39.2 C40.2 C41.2 C42.2 C38.1 C37.1 C36.1 C35.1 128.45,114.5 | C43.2 C44.2 C45.2 C46.2 C34.1 C33.1 C32.1 C31.1 118,113 118,114.5 | 118,114.5 128.45,114.5 | C48.2 62.5,91 | 128.45,114.5 128.45,119.95 128.5,120 | 118,114.5 118,120 | IC1.14 | 22.91,33 IC4.1 25.5,30.85 25.5,9 22.95,7.5 IC4.11 | C4.1 52,23 | 55,23 IC5.16 | IC5.8 51.89,5.11 52,5 | IC5.3 51.69,17.81 52,17.5 | IC9.5 113.36,39.19 C20.1 | 62.54,57.04 v58,55 | JP1.1 19,74.23 v19,45
  Bottom 1: v58.5,114.5 58.5,120 | 70.5,93 67,93 64,93 62.5,93 62.5,91 62.5,90.5 62.5,85 65.5,85 70,85 70.5,85 70.5,88 70.5,93 | 83.5,120 83.5,111.5 | X2.19 97.75,90.75 97.5,91 | 70.5,93 73.5,96 92.5,96 97.5,91 | v11.5,37 11.5,33 | 11.5,33 11.5,22 v10,20.5 | v11.53,32.97 11.5,33 | 52,23 55,23 | 52,23 52,17.5 52,5 52,1 | T3.C T4.C v110.5,80.5 T2.C 110.5,86.5 109,88 107,88 105,86 105,83.5 102.5,81 91.5,81 83,72.5 v83,63.5 v83,51.5 v83,41 v83,22 | 52,23 v52,32.5 | 97.5,91 97.5,84.5 100.77,84.5 X8B.1 | T1.E 62.54,46.46 58,51 v58,55
  Bottom 1.5: v133,93.25 133,1 52,1 1,1 v1,120 v27.5,120 58.5,120 83.5,120 118,120 128.5,120 v133,120 v133,93.25
  pour Bottom: 60,95.5 73,95.5 73,82.5 60,82.5
INT
  Top 0.3: 41.5,41 35,41 34,40 34,38 36,36 36,32 35.5,31.5 24.5,31.5 23.43,30.43 IC4.2 7.57,30.43 7.5,30.5 7.5,42.79 X1.18 | 53.5,51.5 62.5,51.5 65.5,54.5 65.5,67 64.5,68 IC3.84
  Top 0.305: 41.5,41 43,41 53.5,51.5
IOREQ
  Top 0.3: X1.21 4.25,49.25 8,53 15,53 21,59 | 47,63 54.5,70.5 61.5,70.5 62.5,71.5 IC3.80
  Top 0.305: 21,59 45.12,59 47,60.88 47,63
M1  (via drill 0.6)
  Top 0.3: v19,40.5 22,40.5 23.5,39 30.5,39 34.5,43 39.5,43 | v50,54 50,63 54.5,67.5 63,67.5 64,68.5 IC3.83
  Top 0.305: 39.5,43 41,43 v50,52
  Bottom 0.3: X1.19 3.96,46.54 6.5,44 6.5,41.5 7.5,40.5 v19,40.5 | v50,52 v50,54
N$1
  Top 0.5: JP1.2 22.62,78.27 IC1.1 24.5,78 28.5,82 R1.1
  Bottom 0.5: IC1.1
N$2  (via drill 0.6)
  Top 0.5: X7.7 63.96,114.54 61,117.5 v55.5,117.5 | v50,117.5 48.05,117.5 C24.1
  Bottom 0.5: v55.5,117.5 v50,117.5
N$3
  Top 0.5: X1.54 X1.56
N$4  (via drill 0.6)
  Top 0.5: T2.E 109.54,89 102.73,89 X8B.2 95.77,87.27 v95.5,87 | 86.5,73 R30.1 81.55,73.45 v81.5,73.5 81.45,73.45 R32.1 79.5,73
  Bottom 0.5: v95.5,87 v81.5,73.5
N$5
  Bottom 0.5: X8A.2 4.27,107.27 3,106 3,97.71 X1.59
N$6
  Bottom 0.5: 120,73 120,83
N$7
  Bottom 0.5: 120,58 120,68
N$8
  Top 0.5: R9.2 R8.2 25.55,115.45 26,115 26,111 28,109 29.39,109 IC2.13
N$13  (via drill 0.6)
  Top 0.5: R8.1 R13.2 25.95,108.95 v26,109 | v27.5,111 28.5,110 29.2,110 IC2.12
  Bottom 0.5: v26,109 26,109.5 v27.5,111
N$15  (via drill 0.6)
  Top 0.5: Q1.2 20.14,108.59 R16.1 20.5,109.5 v23,112 | v27.5,112.75 29.66,112.75 | IC2.1 35.57,106.57 v35.5,106.5 | v32,112.5 31.5,112.75 29.66,112.75 | 29.66,112.75 IC2.10
  Bottom 0.5: v23,112 26.5,112 v27.5,112.75 | v35.5,106.5 34,106.5 33,107.5 33,111.5 v32,112.5
N$16
  Top 0.5: Q1.1 20.36,113.41 R9.1
N$17  (via drill 0.6)
  Top 0.5: R16.2 R13.1 26.95,107.05 v27,107 | v31.5,108.5 31.5,110.5 30.5,111.5 IC2.11
  Bottom 0.5: v27,107 30,107 v31.5,108.5
N$21
  Top 0.5: T6.B 110.5,18.45 R24.1
N$22
  Top 0.5: T6.C 113.04,15.99 R29.2
N$23
  Top 0.5: R29.1 117.46,13.55 X4.5
N$24
  Top 0.5: R23.1 118.79,25.55 X4.4
N$26
  Top 0.5: X3.5 117.41,37 113.5,37 108.77,41.73 IC9.3 103.5,38.54 D3.A
N$27  (via drill 0.6)
  Top 0.5: R31.1 103.5,52 v105,53.5
  Bottom 0.5: v105,53.5 113.84,53.5 X3.4
N$28
  Top 0.5: R21.1 112.5,51.5 116,48 116,45.96 IC9.7
N$29
  Top 0.5: R31.2 104.91,46.05 IC9.2 106.07,44.27 D3.C
N$30
  Bottom 0.5: IC5.2 46.15,20.35 44.5,22 44.5,27 41,30.5 38.19,30.5 IC4.23
N$31
  Bottom 0.5: IC5.4 46.23,15.27 43.5,18 43.5,23 41,25.5 38.27,25.5 IC4.21
N$32
  Top 0.5: C28.- 91,68 R33.1 R30.2
N$33
  Top 0.5: IC5.6 46.81,10.19 42,15 42,21.5 40.5,23 38.31,23 IC4.20
N$34
  Top 1: L1.2 54,39 C6.+
  Bottom 0.5: 47,23 IC5.1 47.11,22.89 47,23
  Bottom 1: L1.2 48,30.5 47,29.5 47,23 C4.2
N$35
  Bottom 0.5: IC5.5 46.27,12.73 42,17 42,19 40.5,20.5 38.35,20.5 IC4.19
N$37
  Top 0.5: IC6.7 72.73,15.27 63.5,24.5 R7.1
  Bottom 0.5: IC6.6 IC6.7
N$38
  Top 0.5: IC5.11 51.81,10.19 50,12 50,22.5 52,24.5 R7.2
N$39
  Top 0.5: C12.1 80.5,24.95 80.5,28.5 79.27,29.73 IC7.3
  Bottom 0.5: IC5.10 68.65,7.65 71,10 71,21.54 IC7.3
N$40  (via drill 0.6)
  Top 0.5: v69.5,11.5 72.5,11.5 IC6.5
  Bottom 0.5: IC5.12 56.27,12.73 58.5,10.5 64,10.5 65,11.5 v69.5,11.5
N$41
  Top 0.5: IC6.1 66,18 | IC6.1 63.65,15.27 IC5.13 | R17.1 65.5,18.5 IC6.1
N$42
  Top 0.5: IC6.3 65.92,13 62,13 C18.+ 60.5,11.5 53,11.5 52,12.5 52,19 53.35,20.35 IC5.15
N$43
  Top 0.5: R25.2 C25.1 C21.+ 88.08,53.5 IC8.6
N$44
  Top 0.5: C14.+ 90.77,29.73 IC7.6 IC7.7
N$45
  Top 0.5: C15.+ 77.77,32.27 IC7.2 IC7.1
N$46
  Top 0.5: C11.1 86.81,24.14 IC7.5
  Bottom 0.5: IC5.9 73.61,5.11 89.5,21 89.5,24.5 IC7.5
N$47
  Top 0.5: C14.- R14.2 R10.1
N$48
  Top 0.5: C15.- R15.2 R11.1
N$49
  Bottom 0.5: IC5.14 54.62,18 | 54.62,18 54.5,18 | 54.62,18 63.46,18 IC6.2
N$50  (via drill 0.6)
  Top 0.5: C17.2 v66,42.5 R20.1 | T1.C 60,43 v60.5,42.5
  Bottom 0.5: v60.5,42.5 v66,42.5
N$51
  Top 0.5: R14.1 C16.1 R18.2
N$52
  Top 0.5: R19.2 C19.1 R15.1 70.95,40.95 69,39 66.05,39 C17.1
N$53
  Top 0.5: R26.2 C26.1 C22.+ 77.42,53.5 IC8.2
N$54
  Top 0.5: C22.- 76.45,49.5 R19.1
N$55
  Top 0.5: 91.05,50.5 C21.- 87.45,45.95 R18.1
N$56
  Top 0.5: R12.1 56.51,45.95 T1.B
N$57
  Top 0.5: R26.1 C26.2 | C26.2 78.55,58.45 IC8.1 | C26.2 75,59.5 77.5,62 77.5,67.5 C29.+
N$58
  Top 0.5: R25.1 C25.2 | IC8.7 89.99,58.45 C25.2 | C25.2 91,59.5 88.5,62 88.5,67.5 C28.+
N$60
  Top 0.5: R32.2 R34.1 75,68 C29.-
N$61
  Top 0.5: X5.AUD 114.2,65.5 T3.E 110.54,68 105,68 100.05,73.45 R33.2
N$62
  Top 0.5: X6.AUD 117.2,75.5 T4.E 113,75.5 110.5,78 103.5,78 100,75 76.55,75 R34.2
N$63
  Top 0.5: R35.1 108,85.46 T2.B
N$64  (via drill 0.6)
  Top 0.5: R36.2 105.05,60.05 v105,60 | R35.2 105.05,80.05 v105,80 | R37.2 105.05,70.05 v105,70
  Bottom 0.5: T5.C 102.54,21.96 100,24.5 100,55.5 v105,60 v105,70 v105,80
N$65
  Top 0.5: R36.1 108,65.46 T3.B
N$66
  Top 0.5: R37.1 108,75.46 T4.B
N$67
  Top 0.5: C30.+ R28.1 96.45,13.55 95,15 95,23.8 D1.A
N$68  (via drill 0.6)
  Top 0.5: C23.+ v91.5,14.31 | D2.C 102.2,29.7 100,27.5 100,22.81 T5.E
  Bottom 0.5: v91.5,14.31 T5.E
N$69
  Top 0.5: R28.2 R27.1 102.5,17.77 T5.B
OPM  (via drill 0.6)
  Top 0.3: IC4.7 25.23,17.73 v26.5,19 | v26.5,82.5 30.5,86.5 30.5,94.5 34,98 53,98 53,91.5 IC3.58
  Bottom 0.3: v26.5,19 v26.5,82.5
RD  (via drill 0.6)
  Top 0.3: v5.5,28 5.5,48.29 X1.24 | v5.5,23 11.5,23 14,20.5 22.65,20.5 | v7.5,55.5 15,55.5 21.5,61.77 39.45,61.77 v40.5,62.75 | IC3.65 47.5,88 47,88.5 v45.5,88.5
  Top 0.5: 22.65,20.5 IC4.6
  Bottom 0.3: v5.5,28 v5.5,23 | X1.24 8.96,52.04 7,54 7,55 v7.5,55.5 | v40.5,62.75 40.5,67.5 45.5,72.5 v45.5,88.5
RESET  (via drill 0.6)
  Top 0.3: IC3.89 67,77.5 v99,77.5 | 22.77,28 v19,28 6.5,28 v6.5,47
  Top 0.5: IC5.7 48.34,6.5 v59.5,6.5 | v62.5,6.5 v77.5,6.5 | v93.5,27 96.2,29.7 | 96.2,29.7 D1.C | 96.2,29.7 99,32.5 v99,69.5 | 22.77,28 IC4.3
  Bottom 0.3: IC5.7 45.15,7.65 39.5,2.5 21,2.5 19,4.5 v19,28 | v6.5,47 6.5,51.71 X1.25
  Bottom 0.5: v59.5,6.5 v62.5,6.5 | v77.5,6.5 93.5,22.5 v93.5,27 | 99,69 v99,69.5 v99,77.5
ROMCE  (via drill 0.6)
  Top 0.3: v51,90 IC3.61
  Top 0.305: v46,57.62 45.5,58.12 38.68,58.12 IC1.20
  Bottom 0.3: v46,57.62 46,67 50.5,71.5 50.5,89.5 v51,90
RXD  (via drill 0.6)
  Top 0.3: v126,83.5 116.5,93.5 v98,93.5 | IC3.49 61,98.5 v60.5,99
  Top 0.5: IC9.6 114.58,42 117,42 v126,51 121.5,55.5 111.5,55.5 111.45,55.55 R22.1
  Bottom 0.3: v60.5,99 73.5,99 75.5,97 94.5,97 v98,93.5
  Bottom 0.5: v126,83.5 v126,51
SD0  (via drill 0.6)
  Top 0.3: X2.16 123.25,94.5 v115,94.5 104,94.5 98.5,100 72.5,100 72.5,99 71.6,98.6 71.5,98.5 IC3.28
  Top 0.5: R38.2 87,117.5 88,118.5 107.5,118.5 v109,117
  Bottom 0.3: 124.5,95.5 X2.16
  Bottom 0.5: C39.1 124.5,95.5 | v109,117 109,100 v115,94.5
SD1  (via drill 0.6)
  Top 0.3: v111.5,96 121.75,96 X2.15 | IC3.30 70.5,99.5 v71,100
  Top 0.5: R39.2 91,117 91.5,117.5 107,117.5 v107.5,117
  Bottom 0.3: v71,100 73.5,100 76,97.5 95,97.5 96.5,96 v111.5,96
  Bottom 0.406: 121.75,95.5 X2.15
  Bottom 0.5: C43.1 121.75,95.5 | v107.5,117 107.5,99.5 v111.5,96
SD2  (via drill 0.6)
  Top 0.3: X2.14 123.25,97 v107,97 102.5,97 99,100.5 72,100.5 72,99.5 71,99 IC3.29
  Top 0.5: R40.2 93.05,115.95 v93,116
  Bottom 0.3: 124.5,98 X2.14
  Bottom 0.5: C40.1 124.5,98 | v107,97 106,97.5 106,115 103.5,117.5 94.5,117.5 v93,116
SD3  (via drill 0.6)
  Top 0.3: X2.1 120.25,113.25 118.5,111.5 110,111.5 106.5,116 99.05,116 | R41.2 97.05,115.95 | v97,108.5 95.5,107 62,107 IC3.47
  Top 0.5: 99.05,116 R41.2 | 97.05,115.95 v97,116
  Bottom 0.3: v97,116 v97,108.5
  Bottom 0.406: C31.2 121.75,113 X2.1
SD4  (via drill 0.6)
  Top 0.3: X2.13 121.75,98.5 v103,98.5 102,98.5 99.5,101 70,101 IC3.31
  Top 0.5: v87,108 R42.2
  Bottom 0.5: v103,98.5 95.5,98.5 v87,108 | C44.1 121.75,98 X2.13
SD5  (via drill 0.6)
  Top 0.3: X2.12 124.25,100.75 123,99.5 v104,99.5 102,99.5 100,101.5 69.5,101.5 IC3.32
  Top 0.5: v91,108 R43.2
  Bottom 0.3: 124.5,100.5 X2.12
  Bottom 0.5: C41.1 124.5,100.5 | v104,99.5 98.5,99.5 v91,108
SD6  (via drill 0.6)
  Top 0.3: X2.11 121.75,100.5 v105,100.5 102,100.5 100.5,102 69,102 IC3.33
  Top 0.5: v95,108 R44.2
  Bottom 0.5: v105,100.5 101.5,100.5 v95,108 | X2.11 121.75,100.5 C45.1
SD7
  Top 0.3: X2.2 124.25,113.25 123,112 120.5,112 119,110.5 101,110.5 100,109.5 99.05,109.5 | R45.2 99,107.5 98,106.5 62.5,106.5 IC3.46
  Top 0.5: 99.05,109.5 R45.2
  Bottom 0.5: C35.2 124.75,113 X2.2
SLT3  (via drill 0.6)
  Top 0.3: v48,54 v36.5,54 21.25,54 11,43.5 11,41.29 X1.14 | v67.5,69.5 67.5,76.5 66.5,77 IC3.88
  Bottom 0.3: v48,54 48,63 54.5,69.5 v67.5,69.5 | IC1.22 36.27,62.77 36,62.5 36,54 v36.5,54
ST0
  Top 0.3: X2.3 120.75,110.75 119.5,109.5 102,109.5 98.5,106 63,106 IC3.45
  Bottom 0.5: C32.2 121.75,110.5 X2.3
ST1
  Top 0.3: X2.4 124.25,110.75 123,109.5 121,109.5 120,108.5 102,108.5 99,105.5 63.5,105.5 IC3.44
  Bottom 0.5: C36.2 124.75,110.5 X2.4
ST2
  Top 0.3: X2.5 121.75,108 120.5,108 120,107.5 102,107.5 99.5,105 64.5,105 IC3.42
  Bottom 0.5: C33.2 121.75,108 X2.5
ST3
  Top 0.3: X2.6 124.25,108.25 123,107 121,107 120.5,106.5 102,106.5 100,104.5 65,104.5 IC3.41
  Bottom 0.5: C37.2 124.75,108 X2.6
ST4
  Top 0.3: X2.7 121.75,105.5 102.5,105.5 101,104 65.5,104 IC3.40
  Bottom 0.5: C34.2 121.75,105.5 X2.7
ST5
  Top 0.3: X2.8 124.25,105.75 123,104.5 102.5,104.5 101.5,103.5 67,103.5 IC3.37
  Bottom 0.5: C38.2 124.75,105.5 X2.8
ST6
  Top 0.3: X2.9 121.75,103.5 102.5,103.5 102,103 67.5,103 IC3.36
  Bottom 0.5: C46.1 121.75,103 X2.9
ST7
  Top 0.3: X2.10 124.25,103.25 123,102 102.5,102 102,102.5 68,102.5 IC3.35
  Bottom 0.5: C42.1 124.75,103 X2.10
TCK  (via drill 0.6)
  Top 0.3: 58,89.5 IC3.62 v61,89.5
  Top 0.5: R47.2 73.26,115.95 X7.1
  Bottom 0.3: X7.1 71.27,114.27 70,113 66,113 65.2,112.5 65.2,111 64.5,110.5 59.5,110.5 59.5,90.5 v61,89.5
TDI  (via drill 0.6)
  Top 0.3: IC3.4 76,84.5 78,86.5 v78,98.5
  Top 0.5: R46.2 59.74,115.95 X7.9
  Bottom 0.3: v78,98.5 78,110.5 72.5,116.5 63.65,116.5 X7.9
TDO  (via drill 0.6)
  Top 0.3: IC3.73 57.5,84 v57,83.5
  Top 0.5: 69,114.31 X7.3 72.77,118 79.5,118 80.5,117 R48.2
  Bottom 0.3: X7.3 69.04,114.46 68,115.5 66,115.5 65.3,115 65.3,113.5 64.5,113 58,113 58,84 57.5,83.5 v57,83.5
TMS  (via drill 0.6)
  Top 0.3: IC3.15 76,90 76.5,90.5 v76.5,98.5 | v73.5,113 67.77,113 X7.5
  Top 0.5: R49.2 52.5,116 55,118.5 62.27,118.5 X7.5
  Bottom 0.3: v76.5,98.5 76.5,110 v73.5,113
TXD  (via drill 0.6)
  Top 0.3: v125,82.5 115.5,92.5 97.5,92.5 90.5,99.5 73,99.5 73,98.5 72.1,98.1 72,98 IC3.27
  Top 0.5: v125,13 123,10.5 111.55,10.5 R24.2
  Bottom 0.5: v125,82.5 v125,13
WAIT  (via drill 0.6)
  Top 0.3: v19,38 31,38 35,42 40.5,42 | v65.5,68.5 65.5,69 65,70 IC3.85
  Top 0.305: 40.5,42 42,42 v51,51
  Bottom 0.3: X1.17 3.96,44.04 5.5,42.5 5.5,39 6.5,38 v19,38 | v65.5,68.5 64.5,67.5 54.5,67.5 50,63 50,56.5 51,55.5 v51,51
WR  (via drill 0.6)
  Top 0.3: IC3.1 v74.5,81.5 | v63,49.5 55.12,49.5 45.38,39.75 45.38,32.38 39.62,26.62 26.7,26.62 IC4.5 | 3.75,51.75 2.5,50.5 2.5,26 3,25.5 11.5,25.5 14,23 22.69,23
  Top 0.5: X1.23 3.75,51.75 | 22.69,23 IC4.5
  Bottom 0.3: v74.5,81.5 74.5,80.5 72,78 72,71 66.5,65 66.5,53 v63,49.5
(copper drawn outside any net)
  shapes: Bottom circle x7, Top circle x5

### Text on the board
tNames: JTAG | . | GND | Russian Bear | MUSIC | Version 1.0 | KEYBOARD | EPM7160STC100 | BIOS | Version | AUDIO L | GND | KEY | Service Crew | GND | + | + | AUDIO R | 4.7uF | 4.7uF | + | + | GND | 100uF | 100uF | + | + | 4.7uF | 4.7uF | MIDI IN | OPM Module | SFG05/01-B | + | 47uF | X3 | 4.7uF | 4.7uF | + | + | MIDI OUT | RBSC | 2017 | + | 10uF | GND | + | + | 10uF | X4 | 47uF | EXT PWR | +5V
bNames: Version 1.0 | OPM Module | Russian Bear | SFG05/01-B | Service Crew | RBSC | 2017